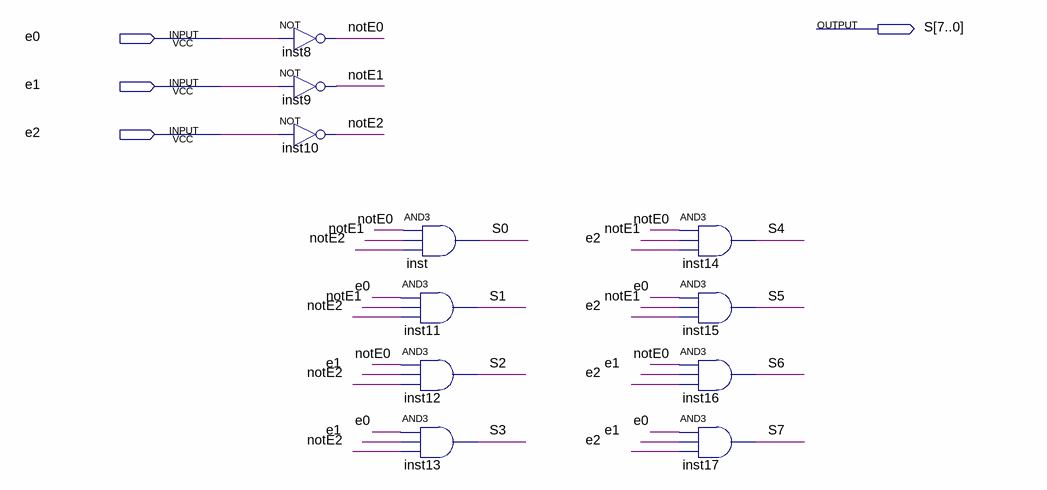
[diagram p0: schematic sheet]
// Quartus schematic decod3x8.bdf as structural Verilog: 11 symbols, 4 pins
module decod3x8 (
  input  e0,
  input  e1,
  input  e2,
  output [7:0] S
);

  wire notE0, notE1, notE2;

  not inst8 (notE0, e0);
  not inst9 (notE1, e1);
  not inst10 (notE2, e2);
  and inst (S[0], notE0, notE1, notE2);
  and inst11 (S[1], e0, notE1, notE2);
  and inst12 (S[2], notE0, e1, notE2);
  and inst13 (S[3], e0, e1, notE2);
  and inst14 (S[4], notE0, notE1, e2);
  and inst15 (S[5], e0, notE1, e2);
  and inst16 (S[6], notE0, e1, e2);
  and inst17 (S[7], e0, e1, e2);
endmodule
